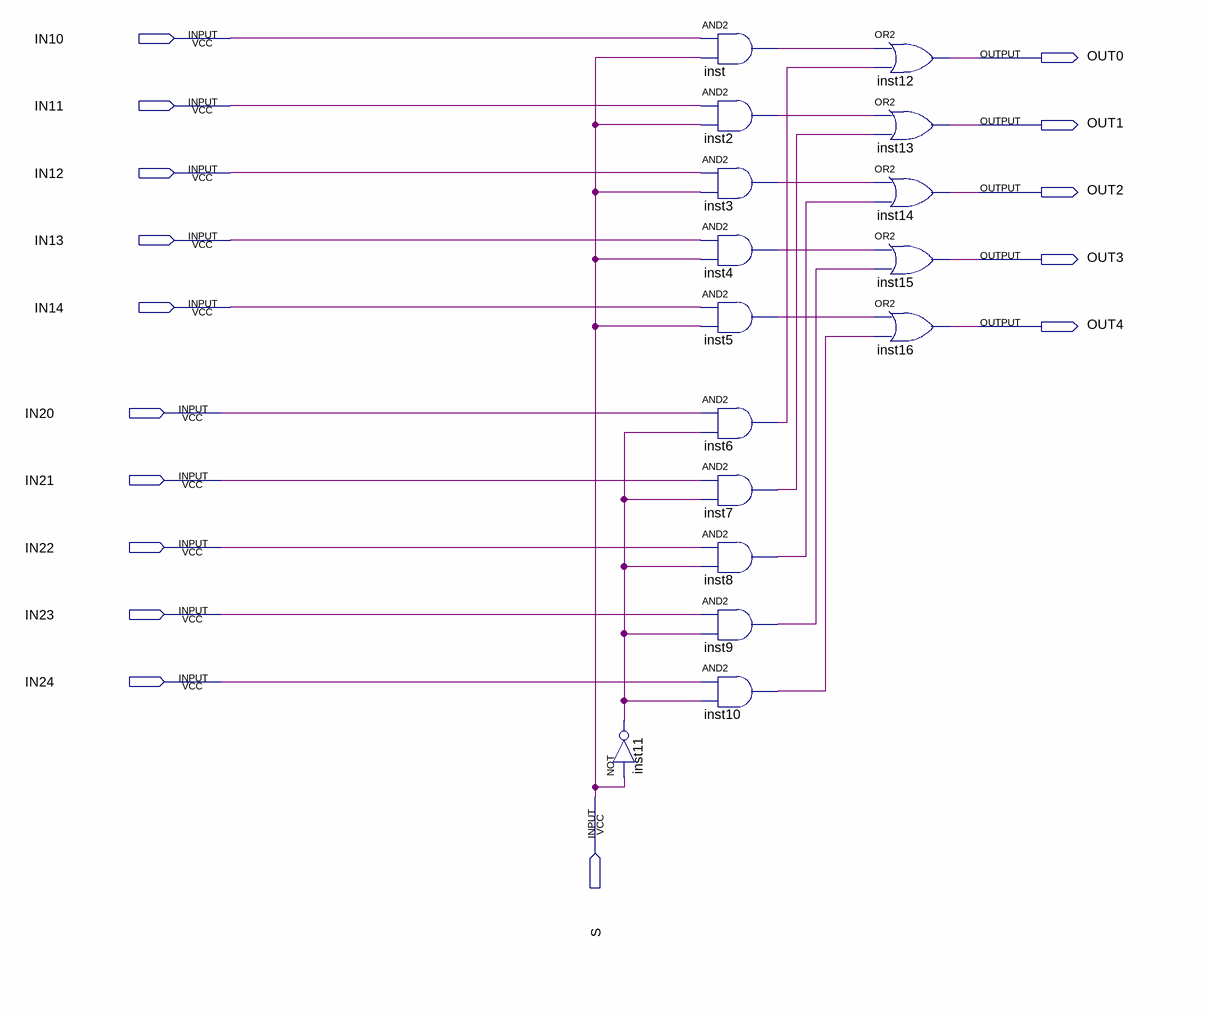
[diagram p0: schematic sheet]
// Quartus schematic sdProjectDemuxNum.bdf as structural Verilog: 16 symbols, 16 pins
module sdProjectDemuxNum (
  input  IN10,
  input  IN11,
  input  IN12,
  input  IN13,
  input  IN14,
  input  IN20,
  input  IN21,
  input  IN22,
  input  IN23,
  input  IN24,
  input  S,
  output OUT0,
  output OUT1,
  output OUT2,
  output OUT3,
  output OUT4
);

  wire inst2_out, inst3_out, inst4_out, inst5_out, inst6_out, inst7_out, inst8_out, inst9_out, inst10_out,
       inst11_out, inst_out;

  not inst11 (inst11_out, S);
  and inst (inst_out, IN10, S);
  and inst2 (inst2_out, IN11, S);
  and inst3 (inst3_out, IN12, S);
  and inst4 (inst4_out, IN13, S);
  and inst5 (inst5_out, IN14, S);
  and inst6 (inst6_out, IN20, inst11_out);
  and inst7 (inst7_out, IN21, inst11_out);
  and inst8 (inst8_out, IN22, inst11_out);
  and inst9 (inst9_out, IN23, inst11_out);
  and inst10 (inst10_out, IN24, inst11_out);
  or inst12 (OUT0, inst_out, inst6_out);
  or inst13 (OUT1, inst2_out, inst7_out);
  or inst14 (OUT2, inst3_out, inst8_out);
  or inst15 (OUT3, inst4_out, inst9_out);
  or inst16 (OUT4, inst5_out, inst10_out);
endmodule
